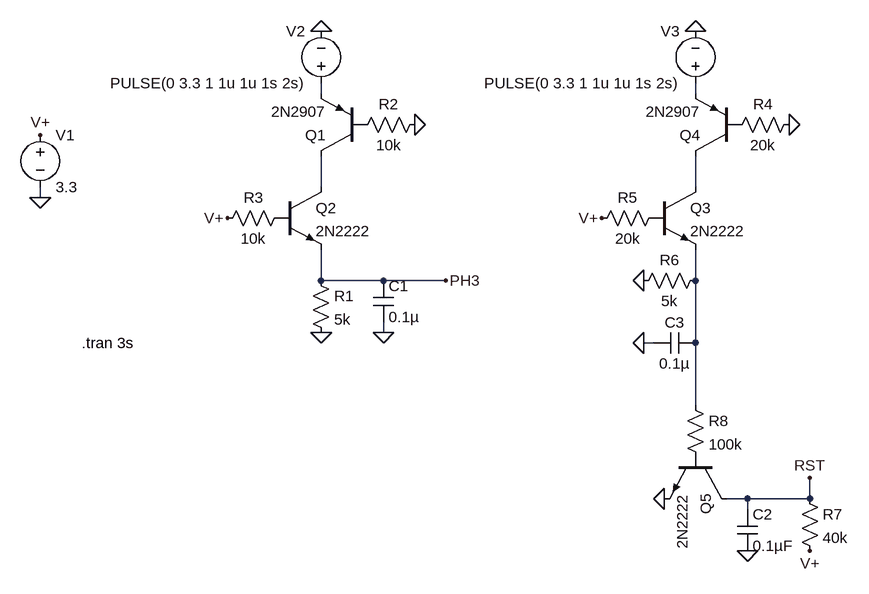
[diagram p0: schematic Bootlock.asc]
Bootlock.asc, the LTspice schematic file:
Version 4.1
SHEET 1 1268 880
WIRE 224 96 224 80
WIRE 800 96 800 80
WIRE 224 240 224 192
WIRE 800 240 800 192
WIRE -208 256 -208 240
WIRE 224 384 224 336
WIRE 320 384 224 384
WIRE 416 384 320 384
WIRE 800 384 800 336
WIRE 320 464 320 448
WIRE 736 480 720 480
WIRE 800 480 800 384
WIRE 800 576 800 480
WIRE 880 720 848 720
WIRE 976 720 976 688
WIRE 976 720 880 720
WIRE 880 736 880 720
WIRE 880 800 880 784
FLAG 416 384 PH3
FLAG -208 256 0
FLAG -208 160 V+
FLAG 224 0 0
FLAG 224 464 0
FLAG 320 464 0
FLAG 80 288 V+
FLAG 368 144 0
FLAG 800 0 0
FLAG 656 288 V+
FLAG 944 144 0
FLAG 752 720 0
FLAG 976 688 RST
FLAG 976 800 V+
FLAG 880 800 0
FLAG 720 384 0
FLAG 720 480 0
SYMBOL npn 160 240 R0
SYMATTR InstName Q2
SYMATTR Value 2N2222
SYMBOL voltage -208 144 R0
WINDOW 123 0 0 Left 0
WINDOW 39 0 0 Left 0
SYMATTR InstName V1
SYMATTR Value 3.3
SYMBOL voltage 224 96 R180
WINDOW 0 24 96 Left 2
WINDOW 3 24 16 Left 2
WINDOW 123 0 0 Left 0
WINDOW 39 0 0 Left 0
SYMATTR InstName V2
SYMATTR Value PULSE(0 3.3 1 1u 1u 1s 2s)
SYMBOL res 208 368 R0
SYMATTR InstName R1
SYMATTR Value 5k
SYMBOL pnp 288 192 R180
SYMATTR InstName Q1
SYMATTR Value 2N2907
SYMBOL res 384 128 R90
WINDOW 0 0 56 VBottom 2
WINDOW 3 32 56 VTop 2
SYMATTR InstName R2
SYMATTR Value 10k
SYMBOL res 176 272 R90
WINDOW 0 0 56 VBottom 2
WINDOW 3 32 56 VTop 2
SYMATTR InstName R3
SYMATTR Value 10k
SYMBOL cap 304 384 R0
SYMATTR InstName C1
SYMATTR Value 0.1µ
SYMBOL npn 736 240 R0
SYMATTR InstName Q3
SYMATTR Value 2N2222
SYMBOL voltage 800 96 R180
WINDOW 0 24 96 Left 2
WINDOW 3 24 16 Left 2
WINDOW 123 0 0 Left 0
WINDOW 39 0 0 Left 0
SYMATTR InstName V3
SYMATTR Value PULSE(0 3.3 1 1u 1u 1s 2s)
SYMBOL pnp 864 192 R180
SYMATTR InstName Q4
SYMATTR Value 2N2907
SYMBOL res 960 128 R90
WINDOW 0 0 56 VBottom 2
WINDOW 3 32 56 VTop 2
SYMATTR InstName R4
SYMATTR Value 20k
SYMBOL res 752 272 R90
WINDOW 0 0 56 VBottom 2
WINDOW 3 32 56 VTop 2
SYMATTR InstName R5
SYMATTR Value 20k
SYMBOL npn 848 656 R90
SYMATTR InstName Q5
SYMATTR Value 2N2222
SYMBOL cap 864 736 R0
SYMATTR InstName C2
SYMATTR Value 0.1µF
SYMBOL res 960 704 R0
SYMATTR InstName R7
SYMATTR Value 40k
SYMBOL res 816 368 R90
WINDOW 0 0 56 VBottom 2
WINDOW 3 32 56 VTop 2
SYMATTR InstName R6
SYMATTR Value 5k
SYMBOL cap 800 464 R90
WINDOW 0 0 32 VBottom 2
WINDOW 3 32 32 VTop 2
SYMATTR InstName C3
SYMATTR Value 0.1µ
SYMBOL res 784 560 R0
SYMATTR InstName R8
SYMATTR Value 100k
TEXT -144 480 Left 2 !.tran 3s

The netlist it stands for:
* Bootlock.asc
Q2 N003 P001 PH3 0 2N2222
V1 V+ 0 3.3
V2 N001 0 PULSE(0 3.3 1 1u 1u 1s 2s)
R1 PH3 0 5k
Q1 N003 P002 N001 0 2N2907
R2 0 P002 10k
R3 P001 V+ 10k
C1 PH3 0 0.1µ
Q3 N004 P003 N005 0 2N2222
V3 N002 0 PULSE(0 3.3 1 1u 1u 1s 2s)
Q4 N004 P004 N002 0 2N2907
R4 0 P004 20k
R5 P003 V+ 20k
Q5 RST P005 0 0 2N2222
C2 RST 0 0.1µF
R7 RST V+ 40k
R6 N005 0 5k
C3 N005 0 0.1µ
R8 N005 P005 100k
.model NPN NPN
.model PNP PNP
.lib standard.bjt
.tran 3s
.backanno
.end